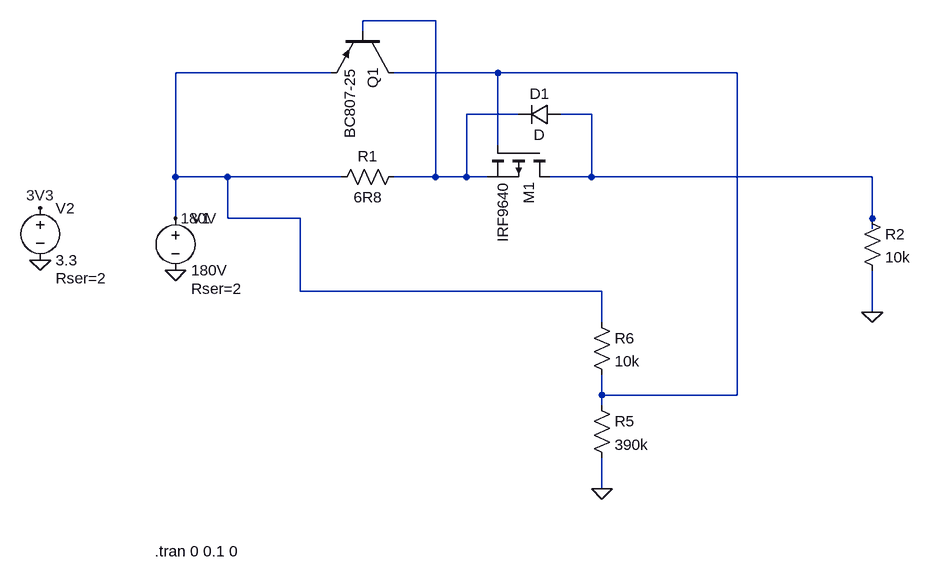
[diagram p0: schematic Current Limiter for Nixie Clock.asc]
Current Limiter for Nixie Clock.asc, the LTspice schematic file:
Version 4
SHEET 1 1144 680
WIRE 384 -320 272 -320
WIRE 272 -304 272 -320
WIRE 224 -240 -16 -240
WIRE 480 -240 320 -240
WIRE 848 -240 480 -240
WIRE 512 -176 432 -176
WIRE 624 -176 576 -176
WIRE 480 -128 480 -240
WIRE -16 -80 -16 -240
WIRE 64 -80 -16 -80
WIRE 240 -80 64 -80
WIRE 384 -80 384 -320
WIRE 384 -80 320 -80
WIRE 432 -80 432 -176
WIRE 432 -80 384 -80
WIRE 464 -80 432 -80
WIRE 624 -80 624 -176
WIRE 624 -80 560 -80
WIRE 1056 -80 624 -80
WIRE -16 -16 -16 -80
WIRE 64 -16 64 -80
WIRE 176 -16 64 -16
WIRE 1056 -16 1056 -80
WIRE 1056 0 1056 -16
WIRE 176 96 176 -16
WIRE 640 96 176 96
WIRE 1056 128 1056 64
WIRE 640 144 640 96
WIRE 640 256 640 224
WIRE 848 256 848 -240
WIRE 848 256 640 256
WIRE 640 272 640 256
WIRE 640 400 640 352
FLAG -16 64 0
FLAG -16 -16 180V
FLAG 640 400 0
FLAG -224 48 0
FLAG -224 -32 3V3
FLAG 1056 128 0
SYMBOL voltage -16 -32 R0
WINDOW 123 0 0 Left 0
WINDOW 39 24 124 Left 2
SYMATTR InstName V1
SYMATTR Value 180V
SYMATTR SpiceLine Rser=2
SYMBOL res 624 256 R0
SYMATTR InstName R5
SYMATTR Value 390k
SYMBOL res 624 128 R0
SYMATTR InstName R6
SYMATTR Value 10k
SYMBOL voltage -224 -48 R0
WINDOW 123 0 0 Left 0
WINDOW 39 24 124 Left 2
SYMATTR InstName V2
SYMATTR Value 3.3
SYMATTR SpiceLine Rser=2
SYMBOL res 336 -96 R90
WINDOW 0 0 56 VBottom 2
WINDOW 3 32 56 VTop 2
SYMATTR InstName R1
SYMATTR Value 6R8
SYMBOL pnp 320 -304 R90
SYMATTR InstName Q1
SYMATTR Value BC807-25
SYMBOL pmos 560 -128 R90
SYMATTR InstName M1
SYMATTR Value IRF9640
SYMBOL res 1040 -32 R0
SYMATTR InstName R2
SYMATTR Value 10k
SYMBOL diode 576 -192 R90
WINDOW 0 0 32 VBottom 2
WINDOW 3 32 32 VTop 2
SYMATTR InstName D1
TEXT -48 496 Left 2 !.tran 0 0.1 0

The netlist it stands for:
* Current Limiter for Nixie Clock.asc
V1 180V 0 180V Rser=2
R5 N002 0 390k
R6 180V N002 10k
V2 3V3 0 3.3 Rser=2
R1 N001 180V 6R8
Q1 N002 N001 180V 0 BC807-25
M1 N003 N002 N001 N001 IRF9640
R2 N003 0 10k
D1 N003 N001 D
.model D D
.lib standard.dio
.model NPN NPN
.model PNP PNP
.lib standard.bjt
.model NMOS NMOS
.model PMOS PMOS
.lib standard.mos
.tran 0 0.1 0
.backanno
.end